# Altium project chickenguard-upgrade.PrjPcb (part 2 of 2)

## Sheet Power.SchDoc: Power supply
size A4; Engineer: CT; SheetNumber: 4; SheetTotal: 5
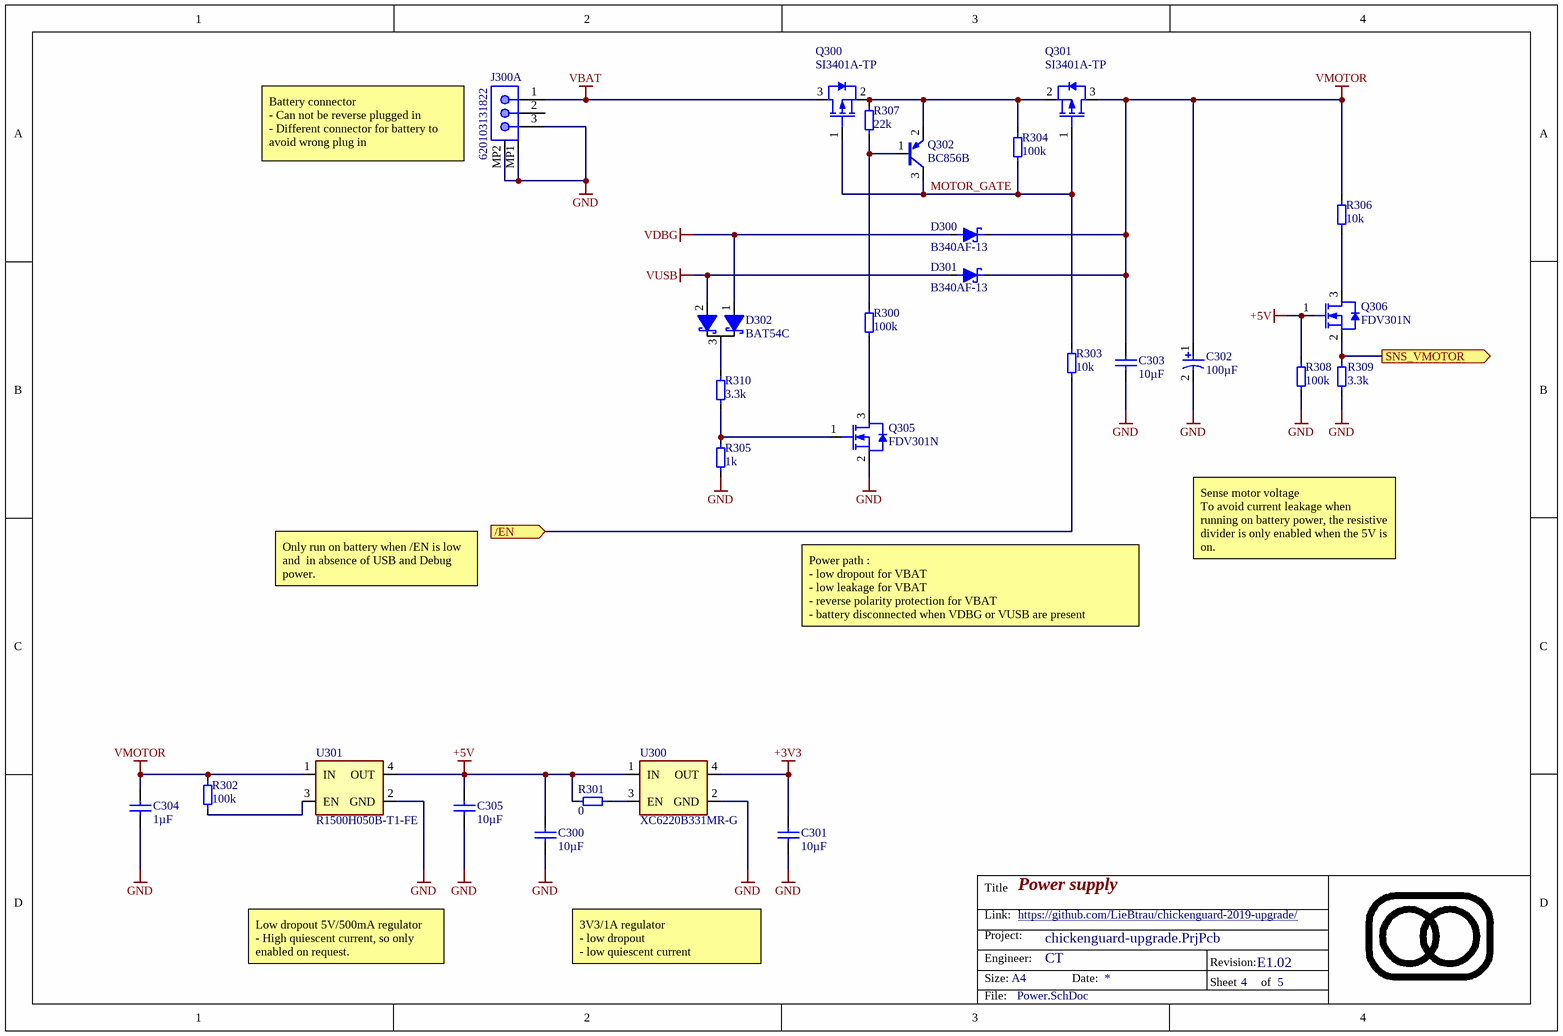
[diagram p4: Power.SchDoc]

### Parts
C300  value 10µF  [0805-C-L]  (hidden comment: Capacitor 10µF +/-10% 10V X7R 0805)
C301  value 10µF  [0805-C-L]  (hidden comment: Capacitor 10µF +/-10% 10V X7R 0805)
C302  value 100µF  [WCAP-ASLL_D6.3H5.5]  (hidden comment: 865060243004)
C303  value 10µF  [0805-C-L]  (hidden comment: Capacitor 10µF +/-10% 10V X7R 0805)
C304  value 1µF  [0603-C-N]  (hidden comment: Capacitor 1µF +/-10% 16V X7R 0603)
C305  value 10µF  [0805-C-L]  (hidden comment: Capacitor 10µF +/-10% 10V X7R 0805)
D300  B340AF-13  [DO-214AC_UNI]
D301  B340AF-13  [DO-214AC_UNI]
D302  BAT54C  [SOT-23-3-N]
J300  620103131822  [620103131822]  (parts A,B of 2)
Q300  SI3401A-TP  [SOT-23-3-N]
Q301  SI3401A-TP  [SOT-23-3-N]
Q302  BC856B  [SOT-23-3-N]
Q305  FDV301N  [SOT-23-3-N]
Q306  FDV301N  [SOT-23-3-N]
R300  value 100k  [0603-R-N]  (hidden comment: Resistor 100k +/-1% 50V 0603)
R301  value 0  [0603-R-N]  (hidden comment: Jumper 0R <50 mOhm 1A 0603)
R302  value 100k  [0603-R-N]  (hidden comment: Resistor 100k +/-1% 50V 0603)
R303  value 10k  [0603-R-N]  (hidden comment: Resistor 10k +/-1% 50V 0603)
R304  value 100k  [0603-R-N]  (hidden comment: Resistor 100k +/-1% 50V 0603)
R305  value 1k  [0603-R-N]  (hidden comment: Resistor 1k +/-1% 50V 0603)
R306  value 10k  [0603-R-N]  (hidden comment: Resistor 10k +/-1% 50V 0603)
R307  value 22k  [0603-R-N]  (hidden comment: Resistor 22k +/-1% 50V 0603)
R308  value 100k  [0603-R-N]  (hidden comment: Resistor 100k +/-1% 50V 0603)
R309  value 3.3k  [0603-R-N]  (hidden comment: Resistor 3.3k +/-1% 50V 0603)
R310  value 3.3k  [0603-R-N]  (hidden comment: Resistor 3.3k +/-1% 50V 0603)
U300  XC6220B331MR-G  [SOT25-N]
U301  R1500H050B-T1-FE  [SOT-89-MT5_N]

### Ports
/EN (in), SNS_VMOTOR (out)

### Nets
+3V3: C301.1 U300.4(OUT)
+5V: C300.1 C305.1 Q306.1(G) R301.1 R308.1 U300.1(IN) U301.4(OUT)
GND: C300.2 C301.2 C302.2 C303.2 C304.2 C305.2 J300.3 J300.MP1 J300.MP2 Q305.2(S) R305.1 R308.2 R309.2 U300.2(GND) U301.2(GND)
VBAT: J300.1 Q300.3(DRAIN)
VDBG: D300.2(A) D302.1(C1)
VMOTOR: C302.1 C303.1 C304.1 D300.1(K) D301.1(K) Q301.3(DRAIN) R302.1 R306.2 U301.1(IN)
VUSB: D301.2(A) D302.2(C2)
/EN: R303.1 ; port /EN
MOTOR_GATE: Q300.1(GATE) Q301.1(GATE) Q302.3(C) R303.2 R304.1
SNS_VMOTOR: Q306.2(S) R309.1 ; port SNS_VMOTOR
NetD302_3: D302.3(A) R310.2
NetQ300_2: Q300.2(SOURCE) Q301.2(SOURCE) Q302.2(E) R304.2 R307.2
NetQ302_1: Q302.1(B) R300.2 R307.1
NetQ305_1: Q305.1(G) R305.2 R310.1
NetQ305_3: Q305.3(D) R300.1
NetQ306_3: Q306.3(D) R306.1
NetR301_2: R301.2 U300.3(EN)
NetR302_2: R302.2 U301.3(EN)

Not connected (* = marked no-connect by the designer): J300 2

### Notes on the sheet
- (near J300) Battery connector
  - Can not be reverse plugged in
  - Different connector for battery to avoid wrong plug in
- Only run on battery when /EN is low and  in absence of USB and Debug power.
- Sense motor voltage
  To avoid current leakage when running on battery power, the resistive divider is only enabled when the 5V is on.
- Power path :
  - low dropout for VBAT
  - low leakage for VBAT
  - reverse polarity protection for VBAT
  - battery disconnected when VDBG or VUSB are present
- Low dropout 5V/500mA regulator
  - High quiescent current, so only enabled on request.
- 3V3/1A regulator
  - low dropout
  - low quiescent current
- Title
- Link:
- Size:
- Project:
- Engineer:
- A4
- Date:
- Revision:
- Sheet
- of
- File:

### Library data of the parts
C300 C301 C303 C305 = CMP-072-000663-10: WCAP-CSGP Multilayer Ceramic Chip Capacitor, General Purpose, size 0805, X7R, 10µF, 10VDC; Technical Reference: X7R0805106K010DFCT10000; Tolerance: 10%; Capacitor Type: MLCC; Insulation Resistance: 0.01GO; Length: 2mm; ComponentLink2URL: https://www.we-online.com/redexpert/spec/885012207026?ad; Packaging: Tape and Reel; ComponentLink1Description: Website Link; Design Item ID: 885012207026; Source: WCAP-CSGP.SchLib; ComponentLink2Description: Datasheet Link; Pins: 2; Usage: General Purpose; Voltage Rating: 10V; Height: 1.25mm; ComponentLink1URL: https://www.we-online.com/redexpert/article/885012207026?ad; Dielectric: X7R; Mounting Technology: SMT; Dissipation Factor: 10%; Min Operating Temperature: -55°C; Width: 1.25mm; Max Operating Temperature: 125°C; Case/Package: 0805; Match Code: WCAP-CSGP; JLCPCB Part #: C15850
C302 = CMP-049-000016-7: WCAP-ASLL Aluminum Electrolytic Capacitor, V-Chip, SMT, D6.3xH5.5mm, 100uF, 10V; Leakage Current: 10uA; Dissipation Factor: 19%; Ripple Current: 240mA; Tolerance: 20%; Mounting Technology: SM; Packaging: Tape and Reel; Voltage Rating: 10V; Diameter: 6.3mm; Height: 5.5mm; Pins: 2; Datasheet URL: https://www.we-online.com/catalog/datasheet/865060243004.pdf; Min Operating Temperature: -55°C; Max Operating Temperature: 105°C; Capacitor Type: Electrolytic
C304 = CMP-001-00004-18: Capacitor MLCC, General Purpose, size 0603, X7R, 1µF, +/-10%, 16V; Tolerance: 10%; Usage: General Purpose; Mounting Technology: SMT; Width: 0.8mm; Voltage Rating: 16V; RoHS Compliant: True; Capacitor Type: MLCC; Case/Package: 0603; Min Operating Temperature: -55°C; Dielectric: X7R; Pins: 2; Max Operating Temperature: 125°C; Length: 1.6mm; Height: 0.8mm; JLCPCB Part #: C15849
D300 D301 = CMP-004-00050-2: Diode 40 V 3A Surface Mount SMAF; Forward Voltage: 500 mV @ 3 A; Max Reverse Voltage (DC): 40V; Packaging: Cut Tape; Forward Current: 3A; Mounting Technology: Surface Mount; Series: -; RoHS Compliant: Yes; Case/Package: SMA
D302 = CMP-004-00045-6: Rectifier Diode Small Signal Schottky 30V 0.2A 5ns Automotive 3-Pin SOT-23 T/R; Forward Current: 200mA; Max Forward Surge Current (Ifsm): 600mA; Forward Voltage: 800mV; Value: 10pF; Element Configuration: Common Cathode; Current Rating: 200A; Lead Free: Lead Free; Pins: 3; Reverse Recovery Time: 5ns; Max Operating Temperature: 150°C; Packaging: Tape and Reel; Reach SVHC Compliant: Yes; Case/Package: SOT-23-3; Max Repetitive Reverse Voltage (Vrrm): 30V; Max Reverse Voltage (DC): 30V; Min Operating Temperature: -55°C; Voltage: 30V; RoHS Compliant: Yes; Termination: SMD/SMT
J300 = CMP-047-000041-7: WR-WTB SMT Male Horizontal Shrouded Header, pitch 2mm, 3p; Withstanding Voltage: 800VAC; Working Voltage: 100VAC; Pin Number: 3; Contact Resistance: 20mOhm; Rated Current: 2A; Design Item ID: 620103131822; Part Number: 620103131822; Pitch: 2mm; Component Type: Standard; Published Date: January 2020; ComponentLink2Description: Datasheet; Pin Count: 3; Source: WR-WTB_2.00mm.SchLib; Type: Horizontal; Packaging: Tape and Reel; Operating Temperature: -25 to +85degC; ComponentLink2URL: https://www.we-online.com/catalog/datasheet/620103131822.pdf; Publisher: Wurth Elektronik; Mounting Technology: SMT; Gender: Male
Q300 Q301 = CMP-013-00056-5: Trans Mosfet P-ch 30V 4.2A 3-PIN SOT-23 T/r; Vgs(th) (Max) @ Id: -1.3V @ 250µA; Input Capacitance: 1.05nF; Rds On Max: 60mR; Max Power Dissipation: 400mW; Transistor Type: PMOS; Packaging: Cut Tape; RoHS Compliant: Yes; Vds Max: 30V; Id - Continuous Drain Current: 4.2A; Max Operating Temperature: 150°C; Series: -; Mounting Technology: Surface Mount; Case/Package: SOT-23-3; Min Operating Temperature: -55°C; JLCPCB Part #: C194253
Q302 = CMP-013-00059-2: Bipolar Transistor, SOT-23, 65V, 100mA, PNP; Power Dissipation: 250mW; Pins: 3; Case/Package: SOT-23; Voltage: 65V; Polarity: PNP; Current: 100mA
Q305 Q306 = CMP-013-00055-7: Transistor MOSFET N-Ch. 25V 220mA 0, 35W 4Ohm SOT23; Fall Time: 6ns; Turn-Off Delay Time: 3.5ns; Max Power Dissipation: 350mW; Number of Channels: 1; Gate to Source Voltage (Vgs): 8V; Vgs(th) (Max) @ Id: 1.06V @250µA; Turn-On Delay Time: 3.2ns; Polarity: N-CHANNEL; Drain to Source Resistance: 5R; Input Capacitance: 9.5pF; Transistor Type: NMOS; Rds On Max: 4R; Length: 2.9mm; Height: 1.2mm; Continuous Drain Current (ID): 220mA; Pins: 3; Package Quantity: 3000; Weight: 0.001093oz; Drain to Source Voltage (Vdss): 25V; Vds Max: 25V; Rise Time: 6ns; Mounting Technology: Surface Mount; Min Operating Temperature: -55°C; Case/Package: SOT-23-3; Max Operating Temperature: 150°C; Width: 1.3mm; Packaging: Tape and Reel; Id - Continuous Drain Current: 220mA; Series: -; Vgs (Max): 8V; JLCPCB Part #: C15310
R300 R302 R304 R308 = CMP-009-00023-20: Chip Resistor, Thick Film, General Purpose, 0603, 100mW, 50V, 100 kOhm, +/-1%; Elements: 1; Tolerance: 1%; JLCPCB Part #: C25803; Min Operating Temperature: -55°C; Usage: General Purpose; Resistor Type: Thick Film; Pins: 2; Mounting Technology: SMT; Case/Package: 0603; Max Operating Temperature: 155°C; RoHS Compliant: True; Voltage Rating: 50V; Power Rating: 100mW
R301 = CMP-009-00006-18: Chip Jumper, Thick Film, Jumper, 0603, 100mW, 1A, 0 Ohm, <50 mOhm; Elements: 1; Tolerance: 50 mOhm; Voltage Rating: 75V; Pins: 2; Usage: Jumper; Min Operating Temperature: -55°C; RoHS Compliant: True; JLCPCB Part #: C21189; Case/Package: 0603; Max Operating Temperature: 155°C; Resistor Type: Thick Film; Power Rating: 100mW; Mounting Technology: SMT; Current Rating: 1A
R303 R306 = CMP-009-00017-19: Chip Resistor, Thick Film, General Purpose, 0603, 100mW, 50V, 10 kOhm, +/-1%; Tolerance: 1%; Elements: 1; Power Rating: 100mW; Usage: General Purpose; Voltage Rating: 50V; Max Operating Temperature: 155°C; Min Operating Temperature: -55°C; RoHS Compliant: True; Pins: 2; Mounting Technology: SMT; JLCPCB Part #: C25804; Case/Package: 0603; Resistor Type: Thick Film
R305 = CMP-009-00184-16: Chip Resistor, Thick Film, General Purpose, 0603, 100mW, 50V, 1 kOhm, +/-1%; Elements: 1; Tolerance: 1%; Temperature Coefficient: 200ppm/°C; JLCPCB Part #: C116692; Min Operating Temperature: -55°C; Usage: General Purpose; Resistor Type: Thick Film; Pins: 2; Mounting Technology: SMT; Case/Package: 0603; Max Operating Temperature: 155°C; RoHS Compliant: True; Voltage Rating: 50V; Power Rating: 100mW; Features: Automotive AEC-Q200
R307 = CMP-009-00245-9: Chip Resistor, Thick Film, General Purpose, 0603, 100mW, 50V, 22 kOhm, +/-1%; Tolerance: 1%; Elements: 1; Case/Package: 0603; Mounting Technology: SMT; Resistor Type: Thick Film; Usage: General Purpose; Voltage Rating: 50V; RoHS Compliant: Yes; Max Operating Temperature: 155°C; Min Operating Temperature: -55°C; Pins: 2; Power Rating: 100mW
R309 = CMP-009-00243-10: Chip Resistor, Thick Film, General Purpose, 0603, 100mW, 50V, 3.3 kOhm, +/-1%; Tolerance: 1%; Elements: 1; Power Rating: 100mW; Voltage Rating: 50V; RoHS Compliant: Yes; Usage: General Purpose; Max Operating Temperature: 155°C; Mounting Technology: SMT; Min Operating Temperature: -55°C; Case/Package: 0603; Pins: 2; Resistor Type: Thick Film; JLCPCB Part #: C22978
R310 = CMP-009-00243-10: Chip Resistor, Thick Film, General Purpose, 0603, 100mW, 50V, 3.3 kOhm, +/-1%; Elements: 1; Tolerance: 1%; JLCPCB Part #: C22978; Usage: General Purpose; Mounting Technology: SMT; Min Operating Temperature: -55°C; Case/Package: 0603; Power Rating: 100mW; Pins: 2; Max Operating Temperature: 155°C; Resistor Type: Thick Film; Voltage Rating: 50V; RoHS Compliant: Yes
U300 = CMP-019-00081-3: Linear Voltage Regulator IC Positive Fixed 1 Output 1A SOT-25-5; pin to pad: 4>5; Output Voltage: 3.3V; Max Input Voltage: 6V; Min Input Voltage: 4V; Output Current: 1A; Case/Package: SOT-23-5
U301 = CMP-019-00086-6: LDO Regulator Pos 5V 0.5A Automotive 6-Pin(5+Tab) SOT-89 T/R; pin to pad: 2>2+3 3>4 4>5; Output Type: Fixed; Output Current: 500mA; Max Input Voltage: 24V; Dropout Voltage: 225mV; Min Input Voltage: 4V; Nominal Output Voltage: 5V; Case/Package: SOT-89-5; Output Voltage: 5V

## Nets that join several sheets
+3V3: LCD (Q200.1 Q201.1), MCU (12 pins), Power (C301.1 U300.4)
+5V: LCD (15 pins), MCU (Q108.1), Motor (R400.2), Power (7 pins)
GND: LCD (12 pins), MCU (20 pins), Motor (22 pins), Power (15 pins)
VBAT: MCU (Q110.1), Power (J300.1 Q300.3)
VDBG: MCU (C105.2 J100.2), Power (D300.2 D302.1)
VMOTOR: Motor (D400.1 D400.2), Power (9 pins)
VUSB: Motor (FB401.2), Power (D301.2 D302.2)
/EN: MCU (5 pins), Power (R303.1)
I2C.SCL: LCD (Q200.2), MCU (Q103.2 R100.1 R105.2)
I2C.SDA: LCD (Q201.2), MCU (D103.2 Q102.2 R106.2 R116.1)
NetD401_1: MCU (R109.2), Motor (D401.1 L401.3)
NetD401_6: MCU (R108.2), Motor (D401.6 L401.2)
NetR104_2: MCU (R104.2 R117.2), Motor (U401.3)
NetR107_2: MCU (R107.2), Motor (U401.2)
SNS_MOTOR_CURRENT: MCU (R102.2), Motor (C404.2 R403.2 U401.1)
SNS_VMOTOR: MCU (HY100.15), Power (Q306.2 R309.1)

## Assembly variants
A: not fitted HY200